# Altium project BLE_tag_hv1.PrjPcb
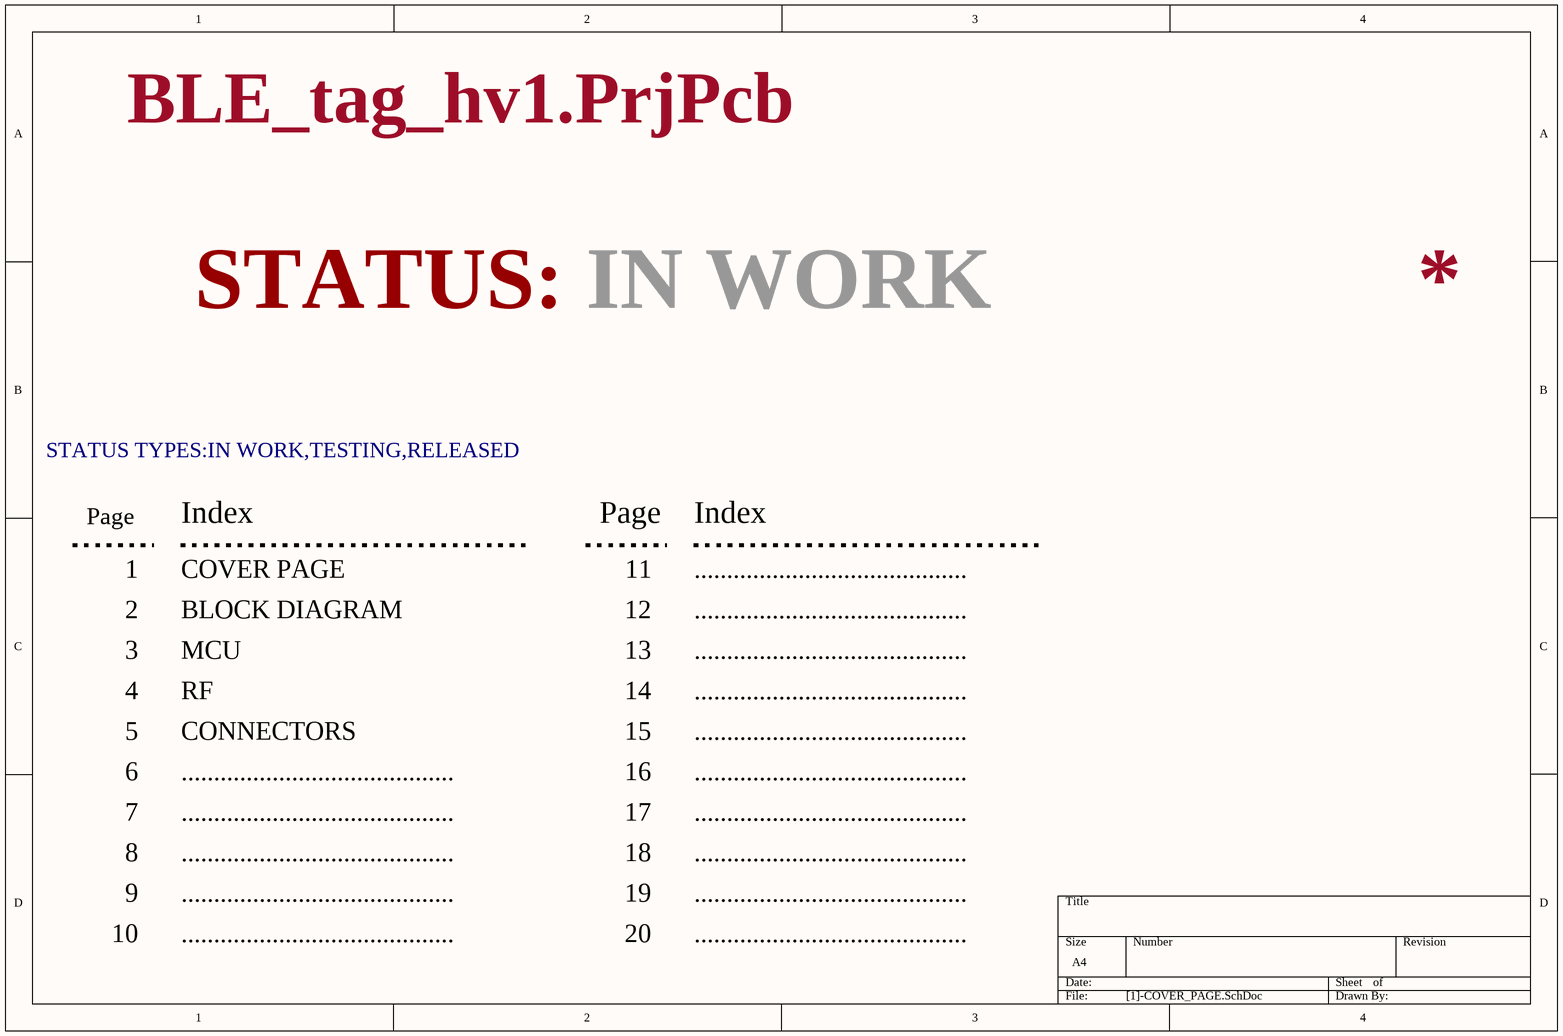
[diagram p0: [1]-COVER_PAGE.SchDoc]
3 sheets, 21 parts. Net scope: flat (ports and power ports of the same name join across sheets).
Board file: BLE_tag_hv1.PcbDoc
Sheets:
  [1]-COVER_PAGE.SchDoc
  [4]-RF.SchDoc
  [5]-CONNECTORS.SchDoc

## Sheet [1]-COVER_PAGE.SchDoc
size A4

### Notes on the sheet
- STATUS:
- IN WORK
- STATUS TYPES:IN WORK,TESTING,RELEASED
- Page
- 1
- Index
- COVER PAGE
- 11
- ..........................................
- 2
- BLOCK DIAGRAM
- 12
- 3
- 4
- MCU
- RF
- 13
- 14
- 5
- 6
- CONNECTORS
- 15
- 16
- 7
- 17
- 8
- 9
- 18
- 19
- 10
- 20

## Sheet [4]-RF.SchDoc
size A4
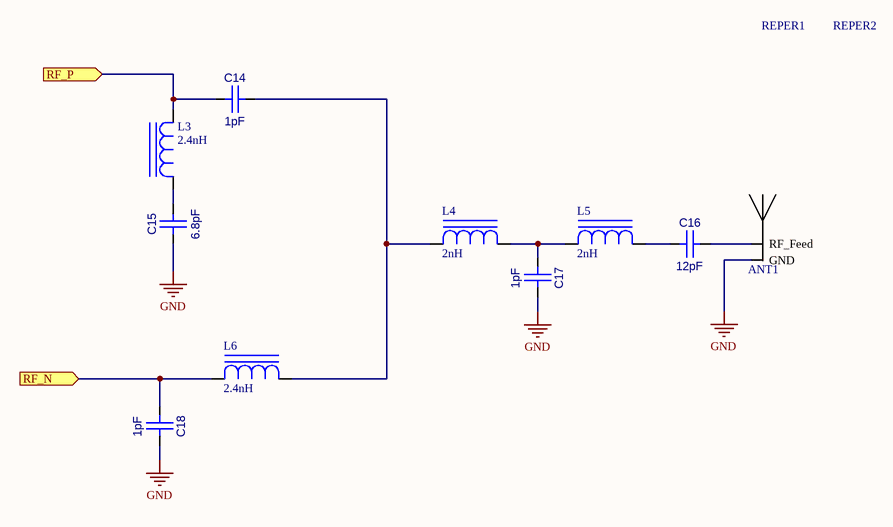
[diagram p1: [4]-RF.SchDoc]

### Parts
ANT1  IFA_TI_2.4G_Reference  [ANT_IFA_2.4G_BEST]  (value not drawn)
C14  1pF  [CC0603]
C15  6.8pF  [CC0603]
C16  12pF  [CC0603]
C17  1pF  [CC0603]
C18  1pF  [CC0603]
L3  2.4nH  [L0402]
L4  2nH  [L0402]
L5  2nH  [L0402]
L6  2.4nH  [L0402]
REPER1  REPER1.2  [REPER1.2]  (value not drawn)
REPER2  REPER1.2  [REPER1.2]  (value not drawn)

### Ports
RF_N (in), RF_P (in)

### Nets
GND: ANT1.2(GND) C15.1(A) C17.2(B) C18.2(B)
NetANT1_1: ANT1.1(RF_Feed) C16.2(B)
NetC14_1: C14.1(A) L3.2(C) ; port RF_P
NetC14_2: C14.2(B) L4.1(A) L6.2(C)
NetC15_2: C15.2(B) L3.1(A)
NetC16_1: C16.1(A) L5.2(C)
NetC17_1: C17.1(A) L4.2(C) L5.1(A)
NetC18_1: C18.1(A) L6.1(A) ; port RF_N

Not connected (* = marked no-connect by the designer): REPER1 1; REPER2 1

### Library data of the parts
ANT1 = ANT_WiFi_IFA_BEST: Value: IFA_TI_2.4G_Reference
C14-C18 = CC0603
  C14 C17 C18: Value: 1pF
  C15: Value: 6.8pF
  C16: Value: 12pF
L3-L6 = L0402
  L3 L6: Value: 2.4nH
  L4 L5: Value: 2nH
REPER1 REPER2 = REPER1.2: Value: *

## Sheet [5]-CONNECTORS.SchDoc
size A4
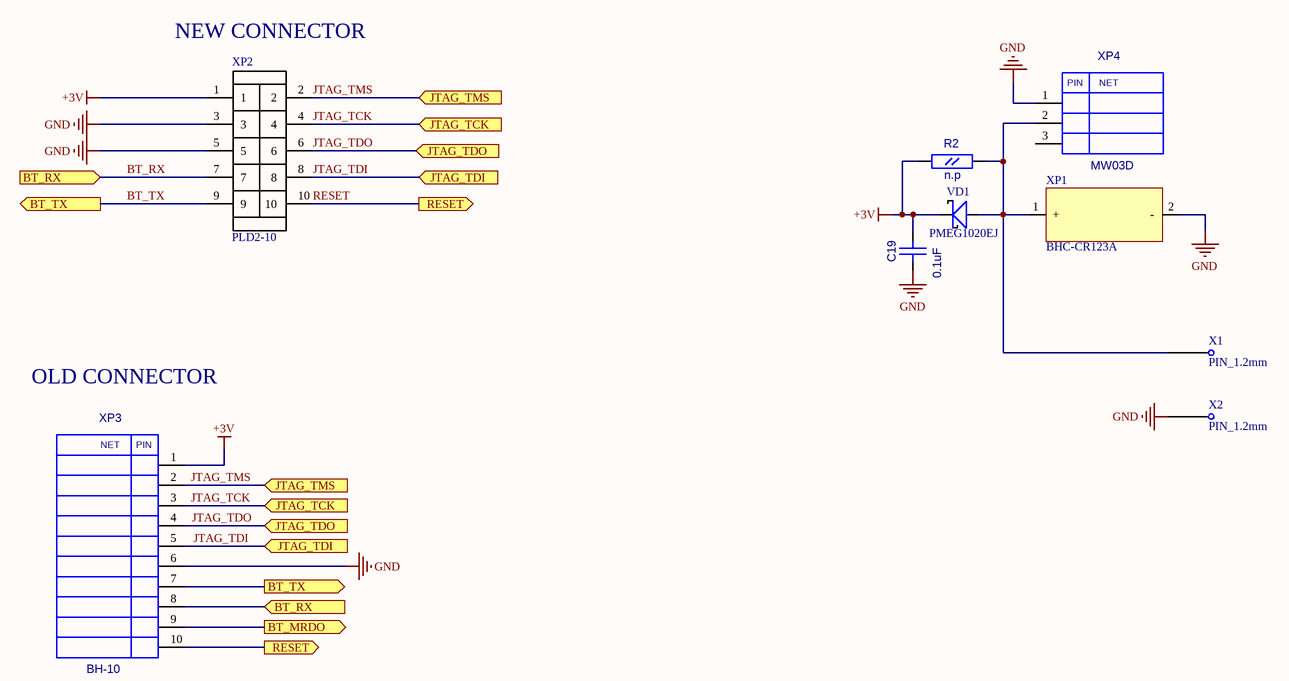
[diagram p2: [5]-CONNECTORS.SchDoc]

### Parts
C19  0.1uF  [CC0603]
R2  n.p  [RC0603]
VD1  PMEG1020EJ  [SOD323]
X1  PIN_1.2mm  [PIN_1.2mm]
X2  PIN_1.2mm  [PIN_1.2mm]
XP1  BHC-CR123A  [CR123_HOLDER]
XP2  PLD2-10  [PLD2-10]
XP3  BH-10  [BH-10]
XP4  MW03D  [MW03D]

### Ports
BT_MRDO (out), BT_RX (in), BT_TX (out), JTAG_TCK (in), JTAG_TDI (in), JTAG_TDO (in), JTAG_TMS (in), RESET (out)

### Nets
+3V: C19.2(B) R2.1(A) VD1.2(K) XP2.1 XP3.1
GND: C19.1(A) X2.1 XP1.2(-) XP2.3 XP2.5 XP3.6 XP4.1
BT_RX: XP2.7 XP3.8 ; port BT_RX
BT_TX: XP2.9 XP3.7 ; port BT_TX
JTAG_TCK: XP2.4 XP3.3 ; port JTAG_TCK
JTAG_TDI: XP2.8 XP3.5 ; port JTAG_TDI
JTAG_TDO: XP2.6 XP3.4 ; port JTAG_TDO
JTAG_TMS: XP2.2 XP3.2 ; port JTAG_TMS
RESET: XP2.10 XP3.10 ; port RESET
NetR2_2: R2.2(B) VD1.1(A) X1.1 XP1.1(+) XP4.2
NetXP3_9: XP3.9 ; port BT_MRDO

Not connected (* = marked no-connect by the designer): XP4 3

### Notes on the sheet
- (near XP2) NEW CONNECTOR
- OLD CONNECTOR
- (in symbol BH-10) NET; PIN
- (in symbol MW03D) PIN; NET

### Library data of the parts
C19 = CC0603: Value: 0.1uF
R2 = RC0603: Value: n.p
VD1 = PMEG2010: Value: PMEG1020EJ
XP1 = BHC-CR123A: Holder for CR123 battery; Value: BHC-CR123A
XP2 = PLD2-10: Value: PLD2-10
XP3 = BH-10: Value: *
XP4 = MW03D: Value: *

## Nets that join several sheets
GND: [4]-RF (ANT1.2 C15.1 C17.2 C18.2), [5]-CONNECTORS (7 pins)